# EAGLE design main (EAGLE 9.6.2)
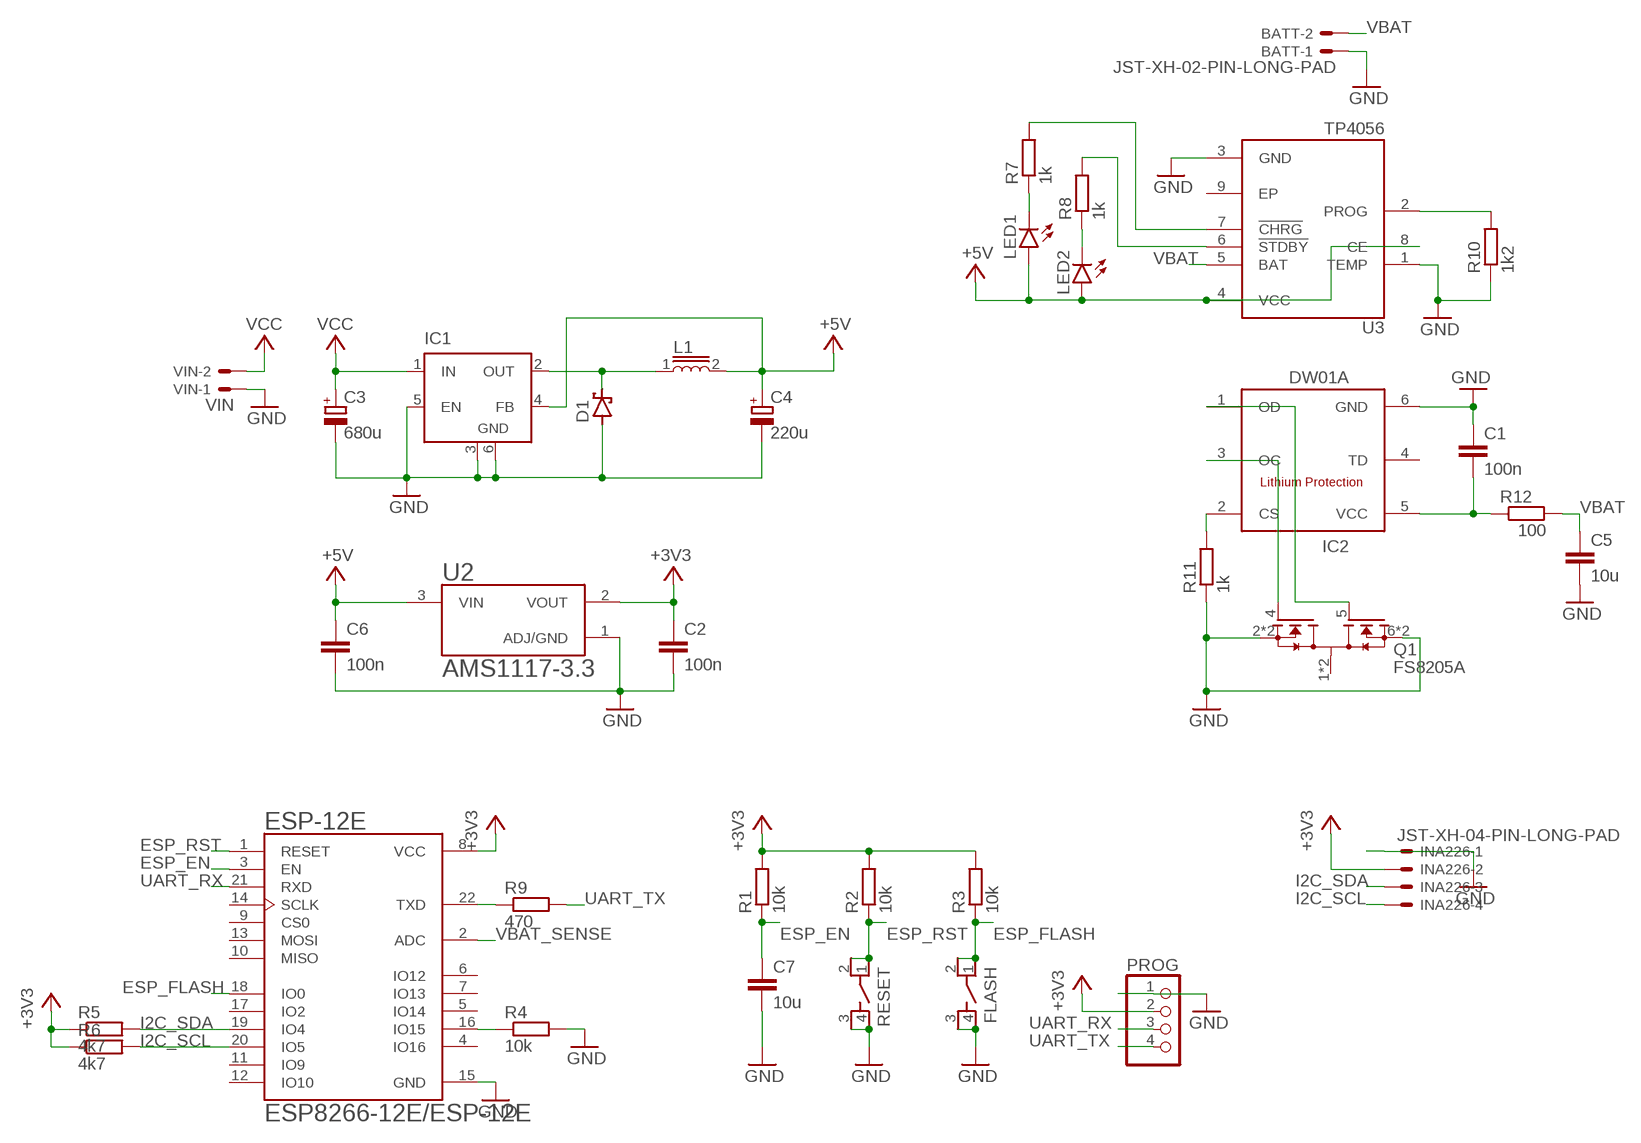
[diagram p0: schematic, sheet 1]

## Parts
BATT  JST-XH-02-PIN-LONG-PAD  [JST-XH-02-PACKAGE-LONG-PAD]
C1  100n  C-EUC0805  [C0805]
C2  100n  C-EUC0805  [C0805]
C3  680u  CPOL-EU150CLZ-1010  [150CLZ-1010]
C4  220u  CPOL-EU150CLZ-0810  [150CLZ-0810]
C5  10u  C-EUC0805  [C0805]
C6  100n  C-EUC0805  [C0805]
C7  10u  C-EUC0805  [C0805]
D1  SCHOTTKY-DIODESMD  [SMB]
ESP-12E  ESP8266-12E/ESP-12E  [XCVR_ESP8266-12E/ESP-12E]
FLASH  PTS810_SJM_250_SMTR_LFS  [SW_PTS810_SJM_250_SMTR_LFS]
IC1  LM2596S  [TO263-5]
IC2  DW01A  [SOT23-6]
INA226  JST-XH-04-PIN-LONG-PAD  [JST-XH-04-PACKAGE-LONG-PAD]
L1  33uH  DR125-6R8-R  [INDM1250X1250X600]
LED1  LEDCHIPLED_0805  [CHIPLED_0805]
LED2  LEDCHIPLED_0805  [CHIPLED_0805]
PROG  PINHD-1X4  [1X04]
Q1  FS8205A  [SOP65P640X120-8N]
R1  10k  R-EU_R0805  [R0805]
R2  10k  R-EU_R0805  [R0805]
R3  10k  R-EU_R0805  [R0805]
R4  10k  R-EU_R0805  [R0805]
R5  4k7  R-EU_R0805  [R0805]
R6  4k7  R-EU_R0805  [R0805]
R7  1k  R-EU_R0805  [R0805]
R8  1k  R-EU_R0805  [R0805]
R9  470  R-EU_R0805  [R0805]
R10  1k2  R-EU_R0805  [R0805]
R11  1k  R-EU_R0805  [R0805]
R12  100  R-EU_R0805  [R0805]
RESET  PTS810_SJM_250_SMTR_LFS  [SW_PTS810_SJM_250_SMTR_LFS]
U2  AMS1117-3.3  [SOT229P700X180-4N]
U3  TP4056  [SOP127P600X175-9N]
VIN  VIN  JST-XH-02-PIN-LONG-PAD  [JST-XH-02-PACKAGE-LONG-PAD]

## Nets
+3V3: C2.1 ESP-12E.8(VCC) INA226.2 PROG.2 R1.2 R2.2 R3.2 R5.1 R6.1 U2.2(VOUT)
+5V: C4.+ C6.1 IC1.4(FB) L1.2 LED1.A LED2.A U2.3(VIN) U3.4(VCC) U3.8(CE)
ESP_EN: C7.1 ESP-12E.3(EN) R1.1
ESP_FLASH: ESP-12E.18(IO0) FLASH.1 FLASH.2 R3.1
ESP_RST: ESP-12E.1(RESET) R2.1 RESET.1 RESET.2
GND: BATT.1 C1.1 C2.2 C3.- C4.- C5.2 C6.2 C7.2 D1.A ESP-12E.15(GND) FLASH.3 FLASH.4 IC1.3(GND) IC1.5(EN) IC1.6(GND) IC2.6(GND) INA226.1 PROG.1 Q1.2(S1) Q1.3(S1) Q1.6(S2) Q1.7(S2) R4.2 R10.1 R11.1 RESET.3 RESET.4 U2.1(ADJ/GND) U3.1(TEMP) U3.3(GND) VIN.1
I2C_SCL: ESP-12E.20(IO5) INA226.4 R6.2
I2C_SDA: ESP-12E.19(IO4) INA226.3 R5.2
N$1: ESP-12E.22(TXD) R9.1
N$2: ESP-12E.16(IO15) R4.1
N$3: LED1.C R7.1
N$4: LED2.C R8.1
N$5: D1.C IC1.2(OUT) L1.1
N$6: R8.2 U3.6(!STDBY)
N$7: R7.2 U3.7(!CHRG)
N$8: R10.2 U3.2(PROG)
N$9: IC2.2(CS) R11.2
N$10: C1.2 IC2.5(VCC) R12.1
N$11: IC2.3(OC) Q1.4(G1)
N$12: IC2.1(OD) Q1.5(G2)
UART_RX: ESP-12E.21(RXD) PROG.3
UART_TX: PROG.4 R9.2
VBAT: BATT.2 C5.1 R12.2 U3.5(BAT)
VBAT_SENSE: ESP-12E.2(ADC)
VCC: C3.+ IC1.1(IN) VIN.2
Unconnected: ESP-12E.4(IO16) ESP-12E.5(IO14) ESP-12E.6(IO12) ESP-12E.7(IO13) ESP-12E.9(CS0) ESP-12E.10(MISO) ESP-12E.11(IO9) ESP-12E.12(IO10) ESP-12E.13(MOSI) ESP-12E.14(SCLK) ESP-12E.17(IO2) IC2.4(TD) Q1.1(D12) Q1.8(D12) U3.9(EP)

## Library data of the parts
BATT = Rembrandt Electronics - JST XH Connectors v1-0-2-2-2:JST-XH-02-PIN: JST XH Connector 2 Pin Wire to board connector. Pitch: 2,54 mm, (0.100") Number of pins: 2 Created by Rembrandt Electronics www.rembrandtelectronics.com
C1 C2 C5-C7 = rcl:C-EU: CAPACITOR, European symbol; SPICEPREFIX: C
C3 C4 = rcl:CPOL-EU: POLARIZED CAPACITOR, European symbol; SPICEPREFIX: C
D1 = diode:SCHOTTKY-DIODE: Schottky Diode
ESP-12E = ESP8266-12E_ESP-12E:ESP8266-12E/ESP-12E: ESP-12E WiFi Module Check prices <https://pricing.snapeda.com/parts/ESP8266-12E/ESP-12E/AI-Thinker/view-part?ref=eda>; AVAILABILITY: Not in stock; DESCRIPTION: This WiFi module has a 32-bit MCU micro and clock speeds supporting 80 MHz or 160 MHz. Supports the RTOS and integrated Wi-Fi MAC/BB/RF/PA/LNA, and has an on-board antenna.; MF: AI-Thinker; MP: ESP8266-12E/ESP-12E; PACKAGE: None; PRICE: None
FLASH RESET = PTS810_SJM_250_SMTR_LFS:PTS810_SJM_250_SMTR_LFS: Switch Tactile Spst-No 0.05a 16v Check prices <https://pricing.snapeda.com/parts/PTS810%20SJM%20250%20SMTR%20LFS/C%26K/view-part?ref=eda>; AVAILABILITY: In Stock; DESCRIPTION: Tactile Switch SPST-NO Top Actuated Surface Mount; MF: C&K; MP: PTS810 SJM 250 SMTR LFS; PACKAGE: None; PRICE: None; PURCHASE-URL: https://pricing.snapeda.com/search/part/PTS810 SJM 250 SMTR LFS/?ref=eda
IC1 = linear:LM2596S: STEP-DOWN VOLTAGE REGULATOR
IC2 = DW01A:DW01A: Check availability <https://pricing.snapeda.com/parts/DW01A/Fortune%20Semiconductor/view-part?ref=eda>; AVAILABILITY: Not in stock; DESCRIPTION: One Cell Lithium-ion/Polymer Battery Protection IC; MF: Fortune Semiconductor; MP: DW01A; PACKAGE: SOT-23-6 Fortune Semiconductor; PRICE: None
INA226 = Rembrandt Electronics - JST XH Connectors v1-0:JST-XH-04-PIN: JST XH Connector 2 Pin Wire to board connector. Pitch: 2,54 mm, (0.100") Number of pins: 4 Created by Rembrandt Electronics www.rembrandtelectronics.com
L1 = DR125-6R8-R:DR125-6R8-R: Inductor Power Shielded Drum Core 3.084u(OCL)H/3.3uH 20% 100KHz Ferrite 9.26A 6.3mOhm DCR T/R Check availability <https://pricing.snapeda.com/parts/DR125-6R8-R/Eaton/view-part?ref=eda>; AVAILABILITY: In Stock; DESCRIPTION: Inductor Power Shielded Drum Core 6.588u(OCL)H/6.8uH 20% 100KHz Ferrite 6.64A 12.3mOhm DCR T/R; MF: Eaton; MP: DR125-6R8-R; PACKAGE: Non Standard Coiltronics / Eaton; PRICE: None; PURCHASE-URL: https://pricing.snapeda.com/search/part/DR125-6R8-R/?ref=eda
LED1 LED2 = led:LED: LED OSRAM: - CHIPLED LG R971, LG N971, LY N971, LG Q971, LY Q971, LO R971, LY R971 LH N974, LH R974 LS Q976, LO Q976, LY Q976 LO Q996 - Hyper CHIPLED LW Q18S LB Q993, LB Q99A, LB R99A - SideLED LS A670, LO A670, LY A670, LG A670, LP A670 LB A673, LV A673, LT A673, LW A673 LH A674 LY A675 LS A676, LA A676, LO A676, LY A676, LW A676 LS A679, LY A679, LG A679 - Hyper Micro SIDELED® LS Y876, LA Y876, LO Y876, LY Y876 LT Y87S - SmartLED LW L88C, LW L88S LB L89C, LB L89S, LG L890 LS L89K, LO L89K, LY L89K LS L896, LA L896, LO L896, LY L896 - TOPLED LS T670, LO T670, LY T670, LG T670, LP T670 LSG T670, LSP T670, LSY T670, LOP T670, LYG T670 LG T671, LOG T671, LSG T671 LB T673, LV T673, LT T673, LW T673 LH T674 LS T676, LA T676, LO T676, LY T676, LB T676, LH T676, LSB T676, LW T676 LB T67C, LV T67C, LT T67C, LS T67K, LO T67K, LY T67K, LW E67C LS E67B, LA E67B, LO E67B, LY E67B, LB E67C, LV E67C, LT E67C LW T67C LS T679, LY T679, LG T679 LS T770, LO T770, LY T770, LG T770, LP T770 LB T773, LV T773, LT T773, LW T773 LH T774 LS E675, LA E675, LY E675, LS T675 LS T776, LA T776, LO T776, LY T776, LB T776 LHGB T686 LT T68C, LB T68C - Hyper Mini TOPLED® LB M676 - Mini TOPLED Santana® LG M470 LS M47K, LO M47K, LY M47K Source: http://www.osram.convergy.de LUXEON: - LUMILED® LXK2-PW12-R00, LXK2-PW12-S00, LXK2-PW14-U00, LXK2-PW14-V00 LXK2-PM12-R00, LXK2-PM12-S00, LXK2-PM14-U00 LXK2-PE12-Q00, LXK2-PE12-R00, LXK2-PE12-S00, LXK2-PE14-T00, LXK2-PE14-U00 LXK2-PB12-K00, LXK2-PB12-L00, LXK2-PB12-M00, LXK2-PB14-N00, LXK2-PB14-P00, LXK2-PB14-Q00 LXK2-PR12-L00, LXK2-PR12-M00, LXK2-PR14-Q00, LXK2-PR14-R00 LXK2-PD12-Q00, LXK2-PD12-R00, LXK2-PD12-S00 LXK2-PH12-R00, LXK2-PH12-S00 LXK2-PL12-P00, LXK2-PL12-Q00, LXK2-PL12-R00 Source: www.luxeon.com KINGBRIGHT: KA-3528ASYC Source: www.kingbright.com
PROG = pinhead:PINHD-1X4: PIN HEADER
Q1 = FS8205A:FS8205A: N/A Check availability <https://pricing.snapeda.com/parts/FS8205A/Fortune%20Semiconductor/view-part?ref=eda>; AVAILABILITY: Not in stock; MF: Fortune Semiconductor; MP: FS8205A; PACKAGE: Package; PRICE: None
R1-R12 = rcl:R-EU_: RESISTOR, European symbol; SPICEPREFIX: R
U2 = AMS1117-3.3:AMS1117-3.3: Sot223/Pkg 1-Amp 3.3-Volt Low Drop Out Voltage Regulatator; AVAILABILITY: Unavailable; DESCRIPTION: Sot223/Pkg 1-Amp 3.3-Volt Low Drop Out Voltage Regulatator; MF: Advanced Monolithic Systems; MP: AMS1117-3.3; PACKAGE: SOT-89 ams; PRICE: None
U3 = TP4056:TP4056: Complete single cell Li-Ion battery with a constant current / constant voltage linear charger Check availability <https://pricing.snapeda.com/parts/TP4056/NanJing%20Top%20Power%20ASIC%20Corp./view-part?ref=eda>; AVAILABILITY: Not in stock; DESCRIPTION: Complete single cell Li-Ion battery with a constant current / constant voltage linear charger; MF: NanJing Top Power ASIC Corp.; MP: TP4056; PACKAGE: None; PRICE: None
VIN = Rembrandt Electronics - JST XH Connectors v1-0-2-2-2-2:JST-XH-02-PIN: JST XH Connector 2 Pin Wire to board connector. Pitch: 2,54 mm, (0.100") Number of pins: 2 Created by Rembrandt Electronics www.rembrandtelectronics.com

## Board
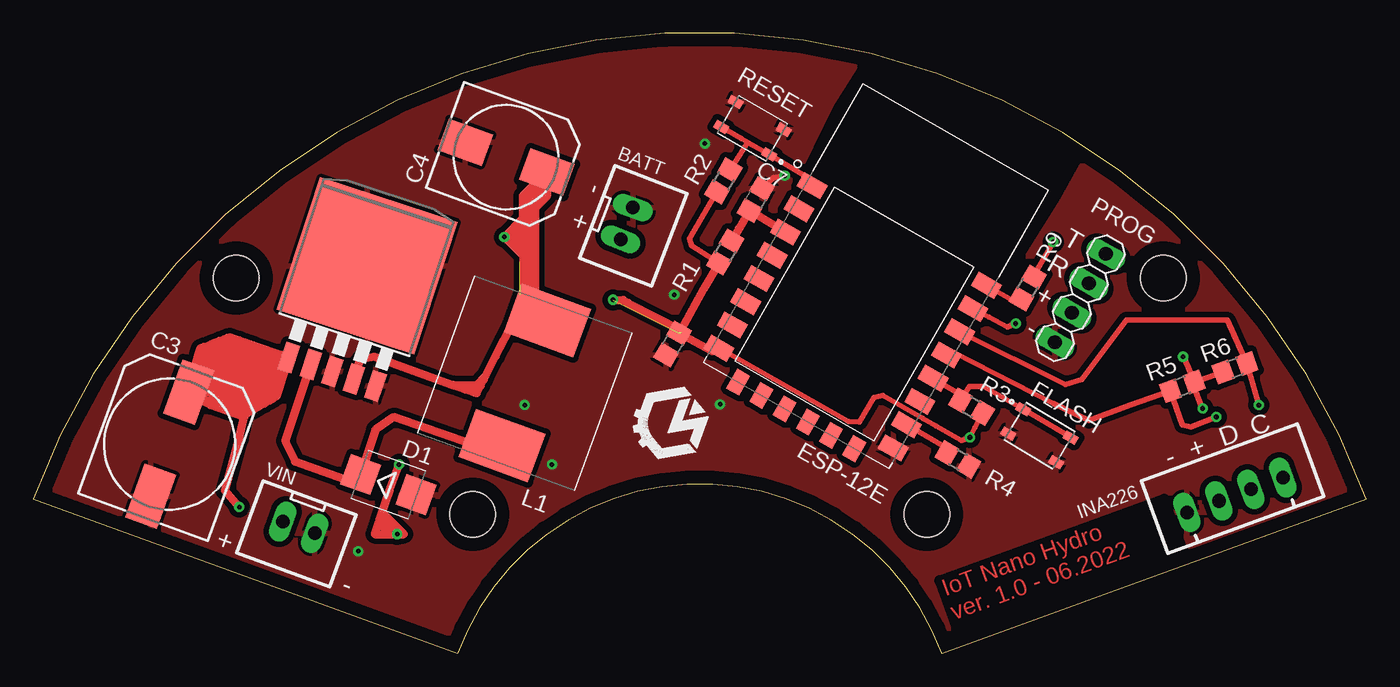
[diagram p1: board, top side]
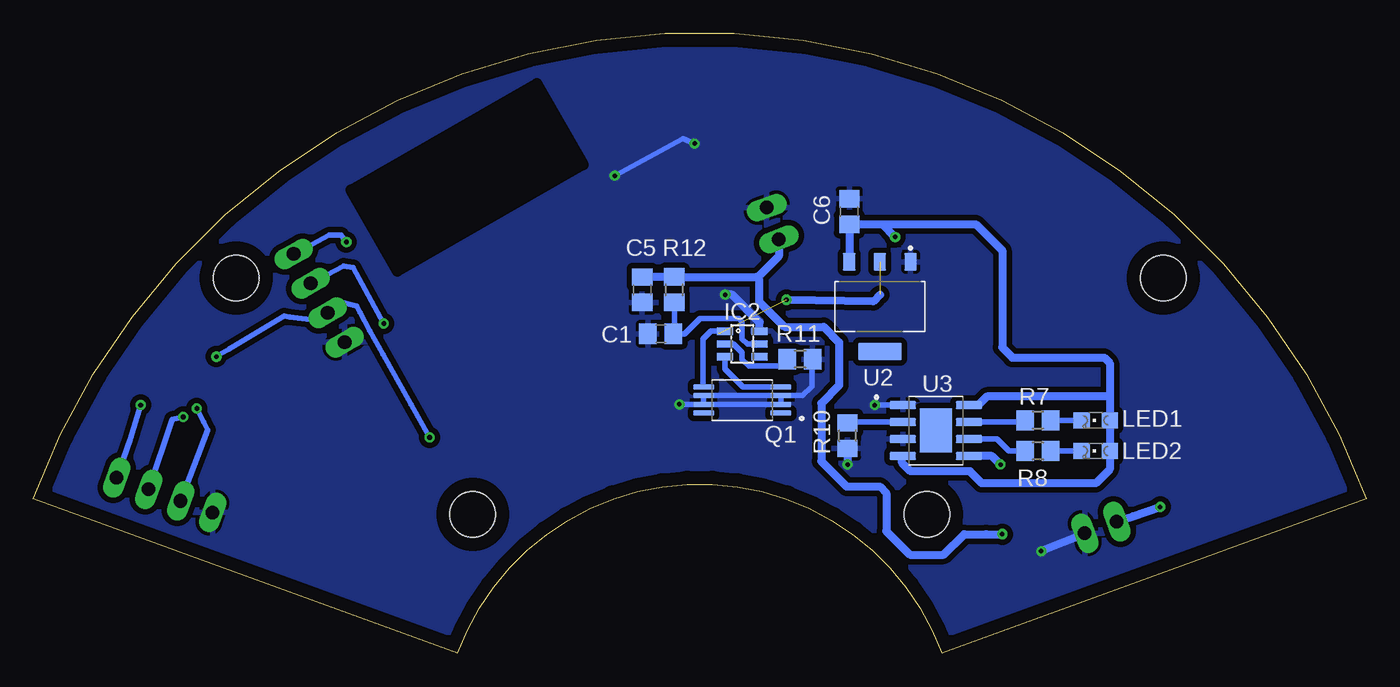
[diagram p2: board, bottom side, seen from below]

Size 99.61 x 46.35 mm. Coordinates in mm from the lower left corner, seen from the top.
Outline: 67.89,0 99.61,11.54 arc140 0,11.54 31.71,0 arc-140 67.89,0
Copper layers (1*16): Top 0.035mm / dielectric 1.5mm / Bottom 0.035mm
Design rules "default": minimum track width 6mil, minimum drill 0.35mm, track to track 6mil, track to pad 6mil, pad to pad 6mil, via to via 6mil, smd to smd 6mil, copper to edge 40mil, drill to drill 6mil, minimum pad ring 10mil, minimum via ring 8mil, stop-mask expansion 4mil, vias tented up to drill 0mil, thermal gap 10mil
Holes 3.4 mm at 15.16,28.06 66.77,10.39 84.45,28.06 32.83,10.39

### Footprints (pad centres in the part's own frame; a part is rotated, then mirrored left to right if it is on the bottom)
JST-XH-02-PACKAGE-LONG-PAD = drill 1.016 long: 1 -1.27,0; 2 1.27,0
C0805 = smd 1.3 x 1.5: 1 -0.95,0; 2 0.95,0
150CLZ-1010 = smd 4.3 x 2.5: + 4.15,0; - -4.15,0
150CLZ-0810 = smd 3.5 x 2.5: + 3.25,0; - -3.25,0
SMB = smd 2.4 x 2.4: A 2.2,0; C -2.2,0
XCVR_ESP8266-12E/ESP-12E = smd 2 x 1.2: 1 -7.5,7; 2 -7.5,5; 3 -7.5,3; 4 -7.5,1; 5 -7.5,-1; 6 -7.5,-3; 7 -7.5,-5; 8 -7.5,-7; 15 7.5,-7; 16 7.5,-5; 17 7.5,-3; 18 7.5,-1; 19 7.5,1; 20 7.5,3; 21 7.5,5; 22 7.5,7 | smd 1.1 x 1.7: 9 -5,-8.5; 10 -3,-8.5; 11 -1,-8.5; 12 1,-8.5; 13 3,-8.5; 14 5,-8.5
SW_PTS810_SJM_250_SMTR_LFS = smd 1.05 x 0.65: 1 -2.075,1.075; 2 2.075,1.075; 3 -2.075,-1.075; 4 2.075,-1.075
TO263-5 = smd 1.067 x 2.159: 1 -3.404,-5.791; 2 -1.702,-5.791; 3 0,-5.791; 4 1.702,-5.791; 5 3.404,-5.791 | smd 10.8 x 10.41: 6 0,2.54
SOT23-6 = smd 0.55 x 1.2: 1 -0.95,-1.3; 2 0,-1.3; 3 0.95,-1.3; 4 0.95,1.3; 5 0,1.3; 6 -0.95,1.3
JST-XH-04-PACKAGE-LONG-PAD = drill 1.016 long: 1 -3.81,0; 2 -1.27,0; 3 1.27,0; 4 3.81,0
INDM1250X1250X600 = smd 3.85 x 5.5: 1 -4.975,0; 2 4.975,0
CHIPLED_0805 = smd 1.2 x 1.2: A 0,-1.05; C 0,1.05
1X04 = drill 1.016 long: 1 -3.81,0; 2 -1.27,0; 3 1.27,0; 4 3.81,0
SOP65P640X120-8N = smd 1.56 x 0.4: 1 -2.88,0.975; 2 -2.88,0.325; 3 -2.88,-0.325; 4 -2.88,-0.975; 5 2.88,-0.975; 6 2.88,-0.325; 7 2.88,0.325; 8 2.88,0.975
R0805 = smd 1.3 x 1.5: 1 -0.95,0; 2 0.95,0
SOT229P700X180-4N = smd 0.93 x 1.31: 1 -2.29,-3.345; 2 0,-3.345; 3 2.29,-3.345 | smd 3.24 x 1.31: 4 0,3.345
SOP127P600X175-9N = smd 1.97 x 0.6: 1 -2.475,1.905; 2 -2.475,0.635; 3 -2.475,-0.635; 4 -2.475,-1.905; 5 2.475,-1.905; 6 2.475,-0.635; 7 2.475,0.635; 8 2.475,1.905 | smd 2.413 x 3.302: 9 0,0

### Placement (x,y rotation side)
BATT  44.34,32.15 249 top
C1  52.72,23.9 0 bottom
C2  47.77,23.13 240 top
C3  10.18,15.64 70 top
C4  35.33,37.1 340 top
C5  54.1,27.19 270 bottom
C6  38.63,33.04 90 bottom
C7  53.99,33.93 60 top
D1  26.53,12.62 340 top
ESP-12E  61.23,25.17 330.2 top
FLASH  75.2,16.28 329.1 top
IC1  24.15,26.56 341.8 top
IC2  46.63,23.13 270 bottom
INA226  89.81,11.83 20 top
L1  36.72,20.21 70 top
LED1  20.21,17.42 90 bottom
LED2  20.21,15.13 90 bottom
PROG  78.25,26.56 60 top
Q1  46.63,18.94 180 bottom
R1  51.71,29.99 240 top
R2  51.58,35.33 240 top
R3  70.12,18.44 330 top
R4  69.11,14.5 330 top
R5  85.87,19.96 200 top
R6  89.81,21.36 20 top
R7  24.53,17.42 180 bottom
R8  24.53,15.13 180 bottom
R9  74.31,27.33 60 top
R10  38.75,16.28 90 bottom
R11  42.31,21.99 180 bottom
R12  51.71,27.2 90 bottom
RESET  53.74,39.26 150 top
U2  36.34,25.93 180 bottom
U3  32.15,16.66 0 bottom
VIN  19.83,9.42 160 top

### Tracks (layer width: path | path; a pad name or v marks a point on that pad's centre or on a via)
+3V3  (via drill 0.35)  (3 unrouted)
  Top 0.406: R5.1 87.89,20.65 R6.1 | R5.1 86.76,19.83 87.27,18.56 v87.4,18.31 | v85.94,22.18 86.32,21.37 R5.1 | ESP-12E.8 60.91,17.36 61.74,17.29 62.84,19.14 63.51,19.27 66.49,17.56 67.44,17.01 69.34,15.91 v70,16.15 70.38,16.88 R3.2 | R2.2 50.98,34.34 49.04,31.01 49.17,30.47 R1.2 | 48.4,23.96 48.59,23.77
  Top 0.61: v43.33,26.44 44.09,26.44 44.44,26.21 48.41,24.18 50.09,27.26 R1.2 | 48.59,23.77 50.73,22.59 ESP-12E.8
  Bottom 0.406: v87.4,18.31 86.89,17.29 86.58,16.71 INA226.2 | v85.94,22.18 84.98,22.75 80.88,25.21 80.45,25.17 78.63,24.91 78.08,25.21 PROG.2 76.77,25.93 76.35,26.18 75.46,25.98 75.2,25.49 74.49,24.14 73.47,22.34 71.39,18.61 v70,16.15
  Bottom 0.61: 36.32,26.82 36.83,26.31 v43.33,26.44
+5V  (via drill 0.35)
  Top 0.61: IC1.4 24.21,21.29 24.46,22 25.46,22.19 31.34,20.08 | 31.34,20.08 31.72,19.95 | 31.72,19.95 32.32,19.73 | 32.32,19.73 33.14,19.44 33.43,20.02 | 33.43,20.02 33.66,20.47 | 33.66,20.47 33.79,20.73 | 33.79,20.73 34.55,22.23 | 34.55,22.23 36.43,25.95 36.6,26.11 | 37.65,25.14 36.31,25.57 34.55,22.23 | 37.65,25.14 38.03,25.02 | 38.03,25.02 L1.2 | 32.92,19.73 33.14,19.73 33.43,20.02 | 32.32,19.73 32.92,19.73 | 32.92,19.73 33.13,19.95 | 31.72,19.95 33.13,19.95 | 33.13,19.95 33.66,20.47 | 31.34,20.08 33.14,20.08 33.79,20.73 | L1.2 38.3,25.02 38.03,25.02 | v35.2,31.14 35.83,31.14 | 35.83,31.14 36.6,30.37 36.6,29.74 | 36.6,29.74 36.6,26.11 | v35.2,31.14 36.6,31.14 | 37.65,25.14 37.1,25.68 37.1,26.44 | 37.1,30.63 36.6,31.14 | 37.1,30.63 37.1,26.44 | 36.6,31.14 36.6,31.9 | 36.6,31.9 36.6,32.53 | 36.6,32.53 36.6,34.21 C4.+ | C4.+ 37.1,34.72 37.1,34.06 | 37.1,33.68 37.1,32.91 | 37.1,32.91 37.1,30.63 | 37.1,33.68 37.1,34.06 | 37.1,34.06 38.5,35.45 38.5,35.07 37.1,33.68 | 35.83,31.14 36.6,31.9 | v35.2,31.14 36.6,32.53 | v35.2,31.14 36.6,29.74 | C4.+ 38.38,34.19 37.48,33.29 | 37.48,33.29 37.1,32.91 | 37.48,33.29 37.48,26.82 37.1,26.44 | L1.2 37.2,26.11 36.6,26.11
  Bottom 0.406: LED2.A 19.16,17.29 LED1.A
  Bottom 0.61: v35.2,31.14 36.15,32.09 | 36.15,32.09 C6.1 U2.3 | 36.15,32.09 29.17,32.09 27.2,30.12 27.2,22.88 26.44,22.12 19.58,22.12 19.16,21.7 19.16,19.2 | 19.16,19.2 19.16,17.29 | 19.16,19.2 28.34,19.2 28.98,18.56 U3.8 | LED1.A LED2.A 19.16,13.77 20.21,12.72 28.72,12.72 29.61,13.61 34.06,13.61 34.69,14.24 34.69,14.69 U3.4
ESP_EN
  Top 0.61: R1.1 52.73,31.77 C7.1 55.51,31.92 ESP-12E.3
ESP_FLASH
  Top 0.406: ESP-12E.18 69.41,19.29 R3.1 69.97,19.96 71.01,19.96 FLASH.1 76.49,16.77 FLASH.2
ESP_RST
  Top 0.406: RESET.2 52.93,38.48 RESET.1 | RESET.1 57.83,35.6 ESP-12E.1 | R2.1 52.81,37.28 53.36,38.17 RESET.1
GND  (via drill 0.35)
  Top 0.406: C7.2 55.3,35.58 v56.15,35.71
  Bottom 0.406: v56.15,35.71 51.07,38.5 v50.18,38.12 | Q1.3 Q1.2 Q1.7 | Q1.3 Q1.6 Q1.7 | R11.1 41.42,21.93 41.42,19.96 42.11,19.27 Q1.3 | U3.1 v36.72,18.56 | Q1.7 51.09,18.62 | 51.09,18.62 | 51.09,18.62 v51.33,18.62
  Bottom 0.61: v24.28,7.64 24.27,7.65 21.07,8.94 VIN.1 | R10.1 v38.75,14.12 | IC2.6 45.33,24.76 47.39,26.82 v47.9,26.82
  pour Top (isolate 0.406): 63.01,46.38 59.71,41.17 57.3,36.22 72.92,27.45 76.73,33.55 80.03,39.52 84.35,37.23 101.49,20.09 101.49,9.16 91.08,-1.25 6.88,-1 5.48,0.4 -3.28,18.69 26.05,48.03 62.38,48.03 63.39,47.39 63.39,47.14
  pour Bottom (isolate 0.406): 25.93,48.15 -3.41,18.82 -3.41,17.93 -3.41,9.16 7,-1.25 91.08,-1.25 101.62,9.29 101.62,19.96 101.37,20.21 73.43,48.15
I2C_SCL  (via drill 0.35)
  Top 0.406: v91.59,18.56 91.08,20.42 R6.2 89.25,24.91 81.68,24.91 78.38,20.47 77.13,20.09 ESP-12E.20
  Bottom 0.406: v91.59,18.56 92.37,16 INA226.4
I2C_SDA  (via drill 0.35)
  Top 0.406: v88.41,17.67 86.51,16.91 85.87,17.09 R5.2 82,18.56 78.89,17.42 76.22,18.69 68.81,22.5 ESP-12E.19
  Bottom 0.406: v88.41,17.67 89.22,17.5 INA226.3
N$1
  Top 0.406: ESP-12E.22 73.21,26.37 R9.1
N$2
  Top 0.406: ESP-12E.16 68.32,15.32 R4.1
N$3
  Bottom 0.406: LED1.C R7.1
N$4
  Bottom 0.406: LED2.C R8.1
N$5
  Top 0.61: IC1.2 18.82,15.89 19.54,14.33 23.75,12.86 D1.C 25.57,16.74 26.93,17.67 33.79,15.27 L1.1
N$6
  Bottom 0.406: R8.2 26.69,15.13 27.58,16.02 U3.6
N$7
  Bottom 0.406: R7.2 25.61,17.29 U3.7
N$8
  Bottom 0.406: U3.2 38.69,17.29 R10.2
N$9
  Bottom 0.406: R11.2 43.77,21.48 46.12,21.48 46.63,21.99 46.63,22.5 47.26,23.13 IC2.2
N$10
  Bottom 0.406: IC2.5 46.25,23.13 46.63,23.52 46.63,24.79 46.88,25.04 49.8,25.04 50.95,23.9 C1.2 51.71,23.96 R12.1
N$11
  Bottom 0.406: Q1.4 46.59,19.92 47.93,21.26 IC2.3
N$12
  Bottom 0.406: IC2.1 48.98,24.08 49.55,23.52 49.55,19.96 Q1.5
UART_RX  (via drill 0.35)
  Top 0.406: ESP-12E.21 71.42,25.14 72.79,24.4 v73.43,24.66
  Bottom 0.406: PROG.3 76.43,28.98 75.71,28.85 v73.43,24.66
UART_TX  (via drill 0.35)
  Top 0.406: v76.22,30.75 74.66,28.05 74.7,28.05 R9.2
  Bottom 0.406: v76.22,30.75 76.6,31.26 77.49,31.26 79.65,30.12 PROG.4
VBAT  (via drill 0.35)
  Top 0.61: v27.32,14.12 26.63,12.24 26,10.38 | 26,10.38 25.85,9.93 25.8,9.8 | 25.8,9.8 25.51,8.92 26.45,8.92 | 26.45,8.92 27.69,8.9 | 27.69,8.9 v27.19,8.92 26,10.11 26,10.38 | 26.45,8.92 26.45,9.15 25.8,9.8 | 27.69,8.9 26.21,10.38 26,10.38
  Bottom 0.61: 45.5,28.09 43.89,29.7 BATT.2 | 45.5,28.09 45.56,28.15 R12.2 54.09,28.15 C5.1 | 45.5,28.09 45.36,27.95 45.36,26.31 43.45,24.4 40.53,24.4 39.39,23.26 39.39,20.04 40.72,18.7 40.72,14.36 38.83,12.47 36.34,12.47 35.85,11.98 35.85,9.14 34.08,7.37 31.58,7.37 30.04,8.91 28.41,8.91 28.4,8.92 v27.19,8.92 | v27.32,14.12 27.96,14.75 U3.5
VCC  (via drill 0.35)
  Top 0.61: 18.43,20.01 18.17,19.21 17.89,19.05 | 18.43,20.01 IC1.1 18.55,22.32 | C3.+ 13.34,18.76 | 13.34,18.76 13.85,18.53 | 13.85,18.53 14.21,18.37 | 14.21,18.37 14.82,18.1 | 15.07,18.01 15.7,17.78 15.92,17.91 | 15.07,18.01 14.82,18.1 | 17.64,18.91 17.89,19.05 | 17.64,18.91 17.25,18.68 | 17.25,18.68 16.75,18.39 | 16.75,18.39 16.51,18.25 | 16.51,18.25 15.92,17.91 | C3.+ 11.95,20.91 12.36,22.37 | 12.36,22.37 12.49,22.83 12.74,22.92 | 12.74,22.92 13.27,23.12 | 13.27,23.12 13.6,23.24 | 13.6,23.24 13.91,23.36 | 13.91,23.36 14.24,23.48 | 14.24,23.48 14.5,23.58 | 14.5,23.58 14.67,23.64 15.39,23.4 | 15.39,23.4 15.73,23.28 | 15.73,23.28 16.23,23.11 | 16.23,23.11 16.45,23.03 | 16.45,23.03 18.55,22.32 | 12.36,22.37 12.41,22.32 | 12.41,22.32 12.97,22.32 | 12.97,22.32 13.23,22.32 | 18.55,22.32 18.43,22.32 | 18.43,22.32 17.8,22.32 | 17.8,22.32 17.42,22.32 | 17.42,22.32 17.29,22.32 | 17.29,22.32 16.53,22.32 | 16.53,22.32 16.02,22.32 | 16.02,22.32 15.64,22.32 | 15.64,22.32 15.26,22.32 | 15.26,22.32 14.75,22.32 | 14.75,22.32 14.37,22.32 | 14.37,22.32 14.12,22.32 | 14.12,22.32 13.86,22.32 | 13.23,22.32 13.86,22.32 | 13.23,22.32 13.23,23.08 13.27,23.12 | 13.23,22.32 12.74,22.81 12.74,22.92 | 13.86,22.32 13.6,22.58 13.6,23.24 | 13.86,22.32 13.91,22.36 13.91,23.36 | 14.37,22.32 14.24,22.45 14.24,23.48 | 14.75,22.32 14.75,23.33 14.5,23.58 | 15.26,22.32 15.26,23.26 15.39,23.4 | 15.64,22.32 15.64,23.19 15.73,23.28 | 16.02,22.32 16.02,22.9 16.23,23.11 | 16.53,22.32 16.53,22.96 16.45,23.03 | C3.+ 13.35,19.54 | 13.35,19.54 13.48,19.54 | 16.62,19.54 16.02,19.54 | 16.02,19.54 15.64,19.54 | 15.39,19.54 15.64,19.54 | 14.75,19.54 15.39,19.54 | 14.75,19.54 14.37,19.54 | 14.37,19.54 13.99,19.54
  Top 0.61: 13.99,19.54 13.48,19.54 | 18.43,22.32 18.43,21.36 18.12,21.04 | 16.62,19.54 16.91,19.83 | 16.91,19.83 17.16,20.09 | 17.35,20.28 17.16,20.09 | 17.35,20.28 17.61,20.53 | 17.61,20.53 18.12,21.04 | C3.+ 12.97,20.92 12.97,22.32 | C3.+ 12.41,20.35 12.41,22.32 | 13.35,19.54 13.35,20.34 13.48,20.21 | 13.48,20.21 13.48,19.54 | 13.86,22.32 13.48,21.94 13.48,20.21 | 13.48,19.54 13.34,19.4 13.34,18.76 | 13.85,18.53 13.85,19.4 | 13.85,19.4 13.99,19.54 | 14.21,18.37 14.21,19.38 | 14.21,19.38 14.37,19.54 | 14.82,18.1 14.75,18.17 14.75,19.54 | 15.07,18.01 15.07,19.23 15.39,19.54 | 15.92,17.91 15.64,18.19 15.64,19.54 | 15.92,17.91 15.92,19.44 16.02,19.54 | 16.75,18.39 16.62,18.53 16.62,19.54 | 16.51,18.25 16.02,18.74 16.02,19.54 | 17.25,18.68 16.91,19.01 16.91,19.83 | 17.64,18.91 17.16,19.38 17.16,20.09 | 17.89,19.05 17.35,19.58 17.35,20.28 | 17.89,19.05 17.89,20.25 | 17.89,20.25 17.61,20.53 | 18.43,20.01 18.43,20.73 | 18.43,20.73 18.12,21.04 | 17.89,20.25 18.36,20.73 18.43,20.73 | 13.85,19.4 13.85,22.05 14.12,22.32 | 14.21,19.38 14.21,21.78 14.65,22.22 | 14.65,22.22 14.75,22.32 | 14.37,19.54 14.65,19.82 14.65,22.22 | 15.39,19.54 15.26,19.67 15.26,22.32 | 15.64,19.54 16.02,19.92 16.02,22.32 | 15.39,19.54 15.64,19.8 15.64,22.32 | 16.62,19.54 16.53,19.63 16.53,21.56 | 16.53,21.56 16.53,22.32 | 16.53,21.56 16.94,21.96 | 16.94,21.96 17.29,22.32 | 17.16,20.09 16.94,20.31 16.94,21.96 | 17.61,20.53 17.42,20.72 17.42,22.32 | 18.12,21.04 17.8,21.36 17.8,22.12 | 17.8,22.12 17.8,22.32 | 18.12,21.04 18.12,21.8 17.8,22.12 | v15.39,10.94 14.32,12.17 15.39,16.02 15.77,17.67 13.23,18.56 11.58,19.26 C3.+
  Bottom 0.61: VIN.2 17.43,10.26 v15.39,10.94

### Text on the board
Top: IoT Nano Hydro / ver. 1.0 - 06.2022
tNames: - | + | T | R | + | - | C | D | + | - | + | -